# Altium schematic sheet ProxSensorType1.SchDoc
size A4; SheetNumber: 1; SheetTotal: 1
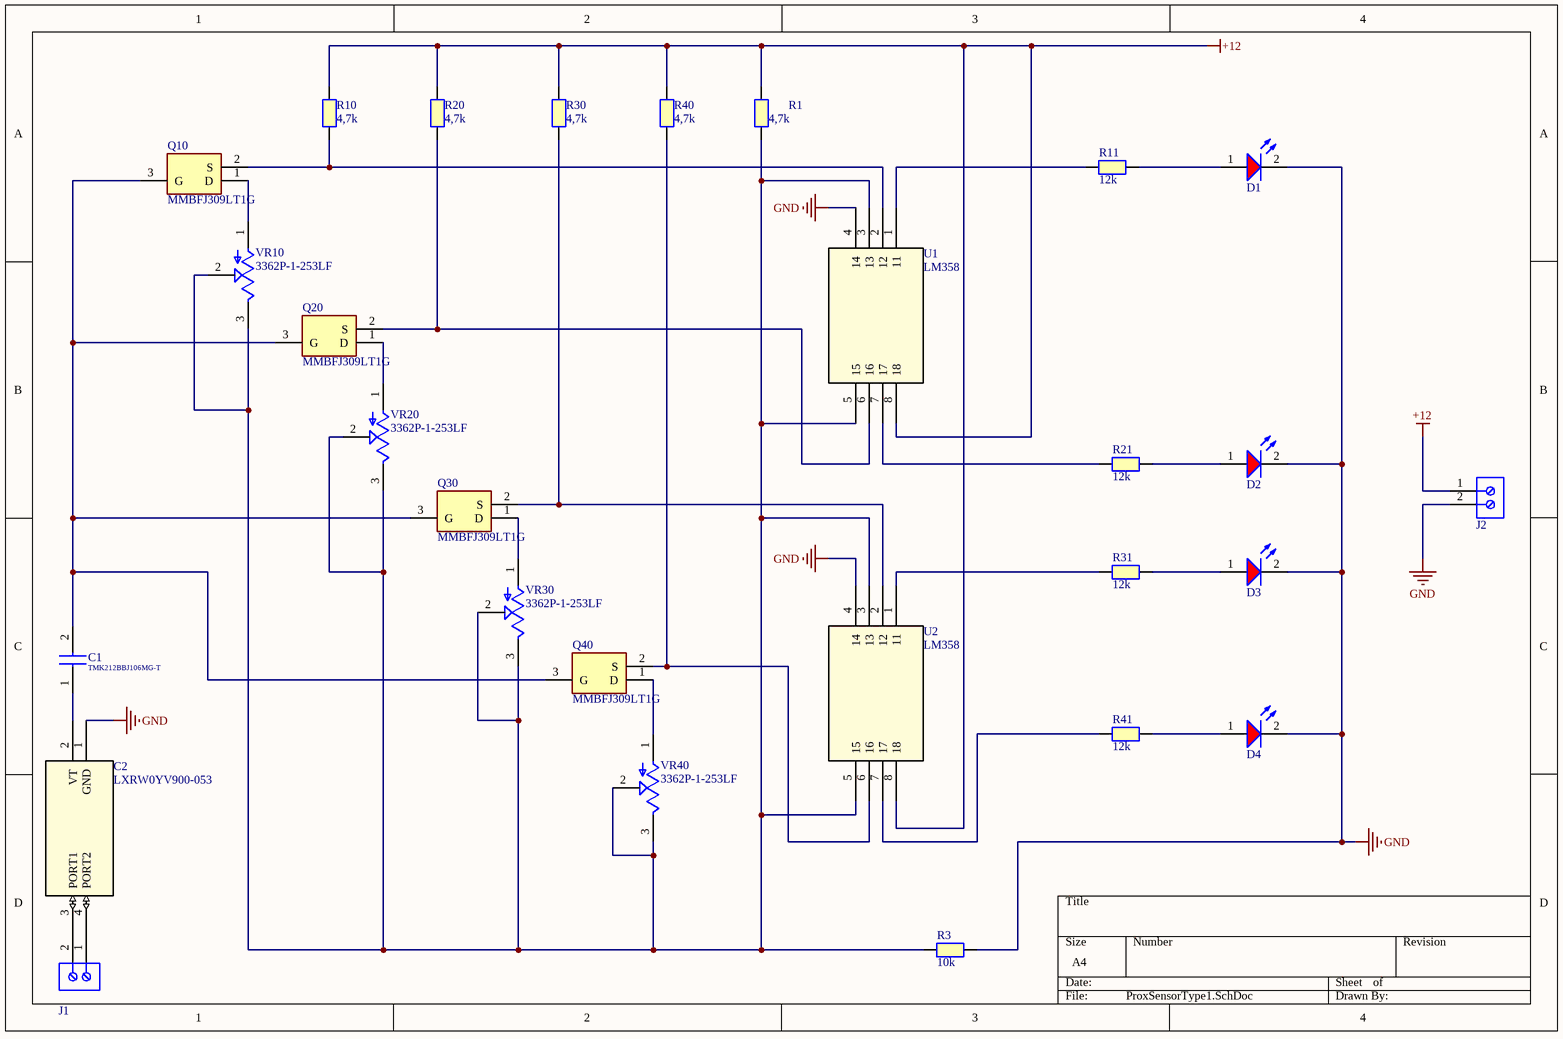
[diagram p0: ProxSensorType1.SchDoc]

## Parts
C1  TMK212BBJ106MG-T  [CAPC2012X65N]
C2  LXRW0YV900-053  [LXRW-0Y_MUR-M]
D1  Super Red, 2.1V, 40°  [WL-TMRC_D5.9H8.7]  (value not drawn)
D2  Super Red, 2.1V, 40°  [WL-TMRC_D5.9H8.7]  (value not drawn)
D3  Super Red, 2.1V, 40°  [WL-TMRC_D5.9H8.7]  (value not drawn)
D4  Super Red, 2.1V, 40°  [WL-TMRC_D5.9H8.7]  (value not drawn)
J1  691210910002  [691210910002]  (value not drawn)
J2  691210910002  [691210910002]  (value not drawn)
Q10  MMBFJ309LT1G  [SOT96P237X111-3N]
Q20  MMBFJ309LT1G  [SOT96P237X111-3N]
Q30  MMBFJ309LT1G  [SOT96P237X111-3N]
Q40  MMBFJ309LT1G  [SOT96P237X111-3N]
R1  4,7k  [RESC2012X50N]
R3  10k  [RESC2012X50N]
R10  4,7k  [RESC2012X50N]
R11  12k  [RESC2012X50N]
R20  4,7k  [RESC2012X50N]
R21  12k  [RESC2012X50N]
R30  4,7k  [RESC2012X50N]
R31  12k  [RESC2012X50N]
R40  4,7k  [RESC2012X50N]
R41  12k  [RESC2012X50N]
U1  LM358  [DIP8_300]
U2  LM358  [DIP8_300]
VR10  3362P-1-253LF  [TRIM_3362P-1-253LF]
VR20  3362P-1-253LF  [TRIM_3362P-1-253LF]
VR30  3362P-1-253LF  [TRIM_3362P-1-253LF]
VR40  3362P-1-253LF  [TRIM_3362P-1-253LF]

## Nets
+12: J2.1 R1.2 R10.2 R20.2 R30.2 R40.2 U1.8(18) U2.8(18)
GND: C2.1(GND) D1.2(K) D2.2(K) D3.2(K) D4.2(K) J2.2 R3.1 U1.4(14) U2.4(14)
NetC1_1: C1.1 C2.2(VT)
NetC1_2: C1.2 Q10.3(G) Q20.3(G) Q30.3(G) Q40.3(G)
NetC2_3: C2.3(PORT1) J1.2
NetC2_4: C2.4(PORT2) J1.1
NetD1_1: D1.1(A) R11.1
NetD2_1: D2.1(A) R21.1
NetD3_1: D3.1(A) R31.1
NetD4_1: D4.1(A) R41.1
NetQ10_1: Q10.1(D) VR10.1(CCW)
NetQ10_2: Q10.2(S) R10.1 U1.2(12)
NetQ20_1: Q20.1(D) VR20.1(CCW)
NetQ20_2: Q20.2(S) R20.1 U1.6(16)
NetQ30_1: Q30.1(D) VR30.1(CCW)
NetQ30_2: Q30.2(S) R30.1 U2.2(12)
NetQ40_1: Q40.1(D) VR40.1(CCW)
NetQ40_2: Q40.2(S) R40.1 U2.6(16)
NetR1_1: R1.1 R3.2 U1.3(13) U1.5(15) U2.3(13) U2.5(15) VR10.2(WIPER) VR10.3(CW) VR20.2(WIPER) VR20.3(CW) VR30.2(WIPER) VR30.3(CW) VR40.2(WIPER) VR40.3(CW)
NetR11_2: R11.2 U1.1(11)
NetR21_2: R21.2 U1.7(17)
NetR31_2: R31.2 U2.1(11)
NetR41_2: R41.2 U2.7(17)

## Library data of the parts
C1 = TMK212BBJ106MG-T: Capacitor; Manufacturer_Name: TAIYO YUDEN; Datasheet Link: https://ds.yuden.co.jp/TYCOMPAS/ut/download?pn=LMK063BBJ474MPLF&fileType=CA; Height: 1.45mm; Manufacturer_Part_Number: TMK212BBJ106MG-T; Mouser Part Number: 963-TMK212BBJ106MG-T; Mouser Price/Stock: https://www.mouser.co.uk/ProductDetail/Taiyo-Yuden/TMK212BBJ106MG-T?qs=lkMpTOwszhd%2F%252Bg1AlFV9dw%3D%3D
C2 = LXRW0YV900-053: Cap trimmer (variable capacitor); Mfr_Name: Murata; Type: DEV; Copyright: Copyright (C) 2023 Ultra Librarian. All rights reserved.; Manufacturer_Part_Number: LXRW0YV900-053; Digi-Key_Part_Number_1: 490-18380-2-ND; Digi-Key_Part_Number_2: 490-18380-1-ND; Digi-Key_Part_Number_3: 490-18380-6-ND; RefDes: RefDes
D1-D4 = LED_151051SS04000: WL-TMRC Mono-color Round Color, THT, D5.9 x H8.7mm, Super Red, 2.1V, 40°; Manufacturer: Wurth Elektronik; Case/Size Code: 5mm; Chip Technology: AlInGaP; Dominant Wavelength: 635nm; Luminous Intensity: 250mcd; Peak Wavelength: 640nm; Manufacturer Part Number: 151051SS04000; Category: Signal LEDs; Match Code: WL-TMRC; ComponentLink1Description: Website Link; ComponentLink1URL: https://www.we-online.com/redexpert/article/151051SS04000?ad; ComponentLink2Description: Datasheet Link; ComponentLink2URL: https://www.we-online.com/redexpert/spec/151051SS04000?ad; Mount: Through Hole; Operating Temperature Max: 85°C; Operating Temperature Min: -40°C; Packaging: Bulk; Height: 8.7mm; Diameter: 5.9mm; Emitting Color: Super Red; Forward Voltage: 2.1V; Viewing Angle: 40°
J1 J2 = 691210910002: WR-TBL Series 2109 Horizontal Entry, THT, pitch 2.54mm, 2p; Manufacturer: Wurth Elektronik; Modularity: No; Rated Current: 6A; Working Voltage: 150V; ComponentLink1Description: Website Link; ComponentLink1URL: https://www.we-online.com/redexpert/article/691210910002?ad; ComponentLink2Description: Datasheet Link; ComponentLink2URL: https://www.we-online.com/redexpert/spec/691210910002?ad; Manufacturer Part Number: 691210910002; Category: Terminal Blocks; Match Code: WR-TBL; Mount: Through Hole; Operating Temperature Max: 105°C; Operating Temperature Min: -40°C; Packaging: Box; Application: Rising Cage Clamp; Number of Pins: 2; Number of Rows: 1; Orientation: Horizontal; Pitch: 2.54mm
Q10 Q20 Q30 Q40 = MMBFJ309LT1G: Transistor; Manufacturer_Name: onsemi; Datasheet Link: http://www.onsemi.com/pub/Collateral/MMBFJ309LT1-D.PDF; Height: 1.11mm; Manufacturer_Part_Number: MMBFJ309LT1G; Mouser Part Number: 863-MMBFJ309LT1G; Mouser Price/Stock: https://www.mouser.co.uk/ProductDetail/onsemi/MMBFJ309LT1G?qs=HVbQlW5zcXXpftXEfcBAsg%3D%3D; Arrow Part Number: MMBFJ309LT1G; Arrow Price/Stock: https://www.arrow.com/en/products/mmbfj309lt1g/on-semiconductor
R1 R10 R20 R30 R40 = RESISTOR 0805: 4,7k Resistor 0805; Part Number: TNPW080510K0BETA; Manufacturer: Vishay Dale
R3 = RESISTOR 0805: 10k Resistor 0805; Part Number: TNPW080510K0BETA; Manufacturer: Vishay Dale
R11 R21 R31 R41 = RESISTOR 0805: 12k Resistor 0805; Part Number: TNPW080510K0BETA; Manufacturer: Vishay Dale
U1 U2 = LM358: Texas instruments LM358 opamp; Copyright: Copyright (C) 2023 Ultra Librarian. All rights reserved.; Mfr_Name: Texas Instruments; Manufacturer_Part_Number: LM358; RefDes: RefDes; Type: DEV
VR10 VR20 VR30 VR40 = 3362P-1-253LF: 25 kOhms 0.5W, 1/2W PC Pins Through Hole Trimmer Potentiometer Cermet 1 Turn Top Adjustment; MF: Bourns; Check_prices: https://www.snapeda.com/parts/3362P-1-253LF/Bourns/view-part/493663/?ref=eda; SnapEDA_Link: https://www.snapeda.com/parts/3362P-1-253LF/Bourns/view-part/493663/?ref=snap; Availability: Good; Value: *; Purchase-URL: https://pricing.snapeda.com/search/part/3362P-1-253LF/?ref=eda; Price: None; MP: 3362P-1-253LF; Package: 3116 Bourns